# Altium schematic sheet 2_SoC.schdoc.schdoc
size 495 x 241 mm; Name: A_A4; Symbol: A_A4; Device: A_A4; @Project Name: Радіо-пристрій Urobo 02; REV: 1.0; Date: 2023-10-07; Sheet: 2/2; Draw By: Nircus; Company: Urobo; Convert to PCB: yes; Add into BOM: yes
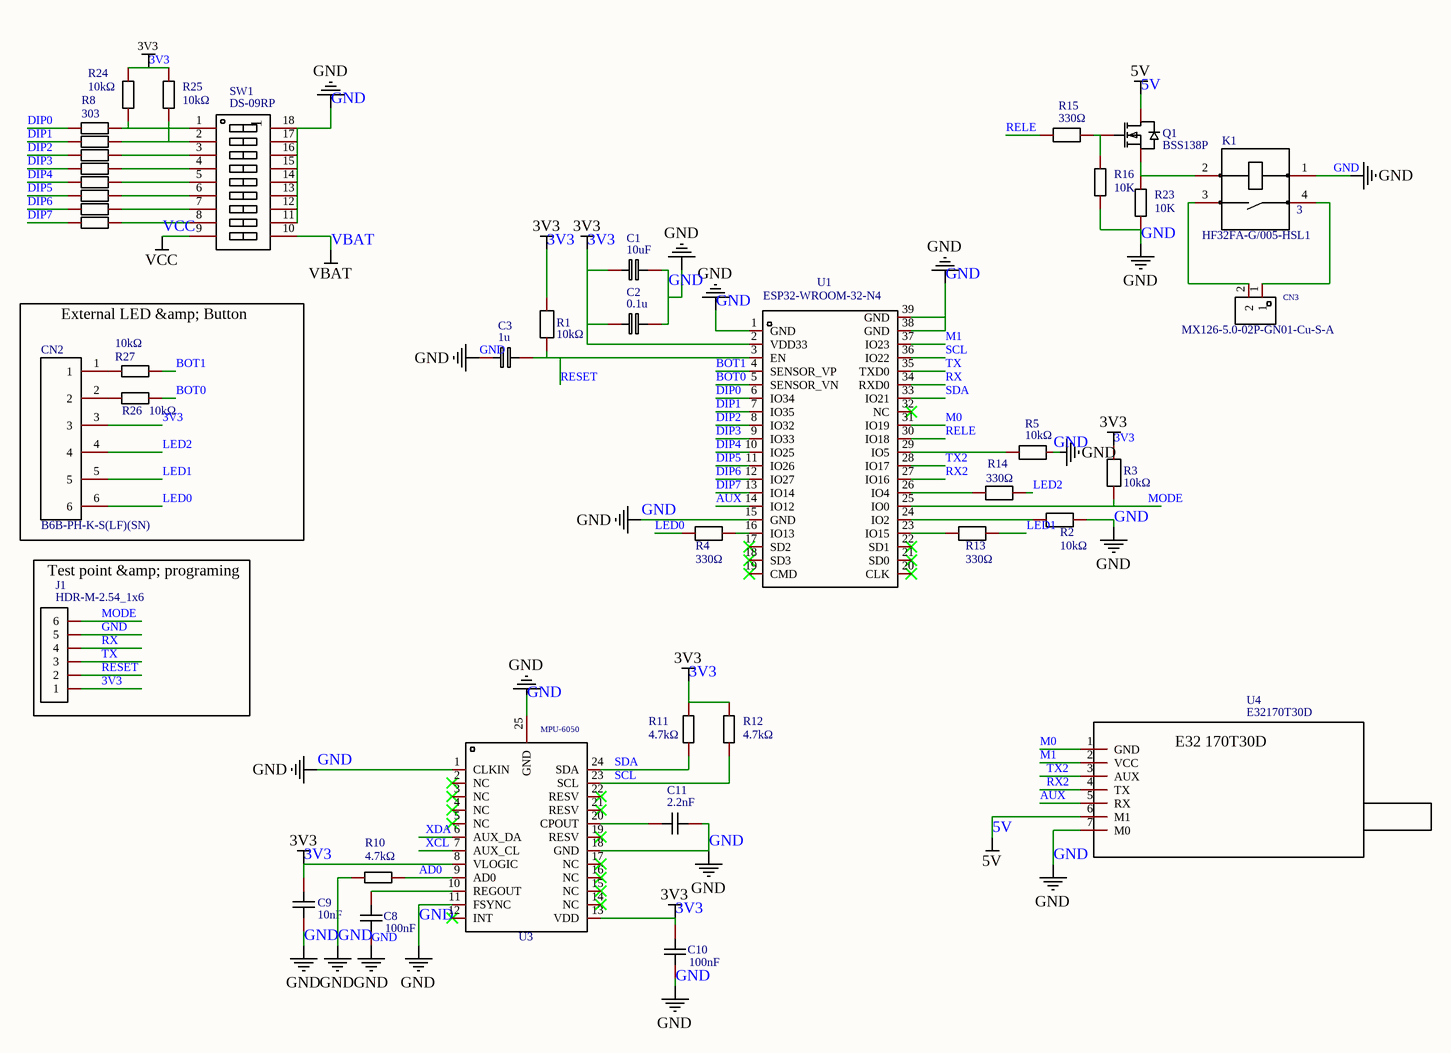
[diagram p0: 2_SoC.schdoc.schdoc]

## Parts
C1  10uF  [C0603]
C2  0.1u  [C0603]
C3  1u  [C0603]
C8  100nF  [C0402]
C9  10nF  [C0402]
C10  100nF  [C0402]
C11  2.2nF  [C0402]
CN2  B6B-PH-K-S(LF)(SN)  [CONN-TH_B6B-PH-K-S]
CN3  MX126-5.0-02P-GN01-Cu-S-A  [CONN-TH_2P-P5.00_MX126-5.0-GN01-02P-CU-S-A]
J1  HDR-M-2.54_1x6  [HDR-M-2.54_1X6]
K1  NUMBER: 3  [RELAY-TH_HF32FA-XX-HXX1X]  (hidden comment: HF32FA-G/005-HSL1)
Q1  BSS138P  [SOT-23-3_L2.9-W1.3-P1.90-LS2.4-BR]
R1  10kΩ  [R0402]
R2  10kΩ  [R0402]
R3  10kΩ  [R0402]
R4  330Ω  [R0603]
R5  10kΩ  [R0402]
R8  303  [R0402]
R9  303  [R0402]  (value not drawn)
R10  4.7kΩ  [R0402]
R11  4.7kΩ  [R0402]
R12  4.7kΩ  [R0402]
R13  330Ω  [R0603]
R14  330Ω  [R0603]
R15  330Ω  [R0603]
R16  10K  [R0402]
R17  303  [R0402]  (value not drawn)
R18  303  [R0402]  (value not drawn)
R19  303  [R0402]  (value not drawn)
R20  303  [R0402]  (value not drawn)
R21  303  [R0402]  (value not drawn)
R22  303  [R0402]  (value not drawn)
R23  10K  [R0402]
R24  10kΩ  [R0402]
R25  10kΩ  [R0402]
R26  10kΩ  [R0402]
R27  10kΩ  [R0402]
SW1  DS-09RP  [SW-TH_18P-L24.4-W9.9-P2.54-LS7.6]
U1  ESP32-WROOM-32-N4  [WIFIM-SMD_ESP32-WROOM-32-N4]
U3  MPU-6050  [QFN-24_L4.0-W4.0-P0.50-BL-EP2.7]
U4  E32170T30D  [E32170T30]

## Blocks framed on the sheet
External LED &amp; Button: CN2 R26 R27
Test point &amp; programing: J1

## Nets
3V3: C1.1 C2.1 C9.1 C10.2 CN2.3 J1.1 R1.2 R3.2 R11.2 R12.2 R24.2 R25.2 U1.2(VDD33) U3.8(VLOGIC) U3.13(VDD)
5V: Q1.3(D) U4.6(M1)
GND: C1.2 C2.2 C3.1 C8.1 C9.2 C10.1 C11.2 J1.5 K1.1 R2.2 R5.2 R10.2 R16.1 R23.1 SW1.11(PIN11) SW1.12(PIN12) SW1.13(PIN13) SW1.14(PIN14) SW1.15(PIN15) SW1.16(PIN16) SW1.17(PIN17) SW1.18(PIN18) U1.1(GND) U1.15(GND) U1.38(GND) U1.39(GND) U3.1(CLKIN) U3.11(FSYNC) U3.18(GND) U3.25(GND) U4.7(M0)
VBAT: SW1.10(PIN10)
VCC: SW1.9(PIN9)
AD0: R10.1 U3.9(AD0)
AUX: U1.14(IO12) U4.5(RX)
BOT0: R26.1 U1.5(SENSOR_VN)
BOT1: R27.1 U1.4(SENSOR_VP)
DIP0: R8.1 U1.6(IO34)
DIP1: R9.1 U1.7(IO35)
DIP2: R17.1 U1.8(IO32)
DIP3: R18.1 U1.9(IO33)
DIP4: R19.1 U1.10(IO25)
DIP5: R20.1 U1.11(IO26)
DIP6: R21.1 U1.12(IO27)
DIP7: R22.1 U1.13(IO14)
LED0: CN2.6 R4.1
LED1: CN2.5 R13.2
LED2: CN2.4 R14.2
M0: U1.31(IO19) U4.1(GND)
M1: U1.37(IO23) U4.2(VCC)
MODE: J1.6 R3.1 U1.25(IO0)
RELE: R15.1 U1.30(IO18)
RESET: C3.2 J1.2 R1.1 U1.3(EN)
RX: J1.4 U1.34(RXD0)
RX2: U1.27(IO16) U4.4(TX)
SCL: R12.1 U1.36(IO22) U3.23(SCL)
SDA: R11.1 U1.33(IO21) U3.24(SDA)
TX: J1.3 U1.35(TXD0)
TX2: U1.28(IO17) U4.3(AUX)
XCL: U3.7(AUX_CL)
XDA: U3.6(AUX_DA)
NetC8_2: C8.2 U3.10(REGOUT)
NetC11_1: C11.1 U3.20(CPOUT)
NetCN2_1: CN2.1 R27.2
NetCN2_2: CN2.2 R26.2
NetCN3_1: CN3.1 K1.4
NetCN3_2: CN3.2 K1.3
NetK1_2: K1.2 Q1.2(S) R23.2
NetQ1_1: Q1.1(G) R15.2 R16.2
NetR2_1: R2.1 U1.24(IO2)
NetR4_2: R4.2 U1.16(IO13)
NetR5_1: R5.1 U1.29(IO5)
NetR8_2: R8.2 R24.1 SW1.1(PIN1)
NetR9_2: R9.2 R25.1 SW1.2(PIN2)
NetR13_1: R13.1 U1.23(IO15)
NetR14_1: R14.1 U1.26(IO4)
NetR17_2: R17.2 SW1.3(PIN3)
NetR18_2: R18.2 SW1.4(PIN4)
NetR19_2: R19.2 SW1.5(PIN5)
NetR20_2: R20.2 SW1.6(PIN6)
NetR21_2: R21.2 SW1.7(PIN7)
NetR22_2: R22.2 SW1.8(PIN8)

Not connected (* = marked no-connect by the designer): U1 17(SD2)* 18(SD3)* 19(CMD)* 20(CLK)* 21(SD0)* 22(SD1)* 32(NC)*; U3 2(NC)* 3(NC)* 4(NC)* 5(NC)* 12(INT)* 14(NC)* 15(NC)* 16(NC)* 17(NC)* 19(RESV)* 21(RESV)* 22(RESV)*

## Notes on the sheet
- 1
- 2
- 3
- 4
- 5
- A
- B
- C
- D
- TITLE:
- Радіо-пристрій Urobo 02
- REV:
- 1.0
- Date:
- Company:
- 2023-10-07
- Urobo
- Drawn By:
- Nircus
- Sheet:
- 2/2
- (in symbol E32170T30D) E32 170T30D

## Library data of the parts
C1 = CL10A106MQ8NNNC: Capacitance: Tolerance:±20% Tolerance:±20% Voltage Rated: Temperature Coefficient:; Manufacturer: SAMSUNG(三星); Symbol: 10u; Add into BOM: yes; Tolerance: ±20%; Name: 10uF; Device: CL10A106MQ8NNNC; LCSC Part Name: 10uF ±20% 6.3V; Supplier Part: C1691; Manufacturer Part: CL10A106MQ8NNNC; Supplier Footprint: 0603; JLCPCB Part Class: Extended Part; Datasheet: https://atta.szlcsc.com/upload/public/pdf/source/20160103/1457707690948.pdf; Supplier: LCSC; Convert to PCB: yes; Value: 10uF; Origin Footprint: C0603
C2 = 0.1u: Manufacturer Part: C0603C104K5RACAUTO; Manufacturer: KEMET(基美); Convert to PCB: yes; Name: 0.1u; Symbol: 0.1u; Device: 0.1u; Supplier Part: C129621; Supplier: LCSC; Add into BOM: yes; Origin Footprint: C0603
C3 = 1u: Manufacturer Part: CC0603ZRY5V8BB105; Manufacturer: YAGEO(国巨); Convert to PCB: yes; Name: 1u; Symbol: 1u; Device: 1u; Supplier Part: C106848; Supplier: LCSC; Add into BOM: yes; Origin Footprint: C0603
C8 C10 = FCC0402B104K250AT: Capacitance: Tolerance:±10% Tolerance:±10% Voltage Rated: Temperature Coefficient:; Manufacturer: FOJAN(富捷); Add into BOM: yes; Tolerance: ±10%; Name: 100nF; Symbol: 100nF; Device: FCC0402B104K250AT; LCSC Part Name: 100nF ±10% 25V; Supplier Part: C5137489; Manufacturer Part: FCC0402B104K250AT; Supplier Footprint: 0402; JLCPCB Part Class: Extended Part; Datasheet: https://atta.szlcsc.com/upload/public/pdf/source/20220818/0EB3B7FB2F5648AC16609637FBA7DABE.pdf; Supplier: LCSC; Convert to PCB: yes; Value: 100nF; Origin Footprint: C0402; link: https://lcsc.com/eda_search?q=C272879&amp;%26type=1&amp;ref=editor
C9 = 10nF: Manufacturer: YAGEO(国巨); Manufacturer Part: CC0402KRX7R7BB103; Convert to PCB: yes; Name: 10nF; Symbol: 10nF; Device: 10nF; Supplier: LCSC; Supplier Part: C327009; JLCPCB Part Class: Extended Part; link: https://lcsc.com/eda_search?q=C327009&amp;%26type=1&amp;ref=editor; Add into BOM: yes; Origin Footprint: C0402
C11 = CC0402KRX7R6BB222: Capacitance: Tolerance:±10% Tolerance:±10% Voltage Rated: Temperature Coefficient:; Manufacturer: YAGEO(国巨); Add into BOM: yes; Tolerance: ±10%; Name: 2.2nF; Symbol: 2.2nF; Device: CC0402KRX7R6BB222; LCSC Part Name: 2.2nF ±10% 10V; Supplier Part: C541373; Manufacturer Part: CC0402KRX7R6BB222; Supplier Footprint: 0402; JLCPCB Part Class: Extended Part; Datasheet: https://atta.szlcsc.com/upload/public/pdf/source/20200615/C541373_6B623ACB8FC049B264195929A235C235.pdf; Supplier: LCSC; Convert to PCB: yes; Value: 2.2nF; Origin Footprint: C0402; link: https://lcsc.com/eda_search?q=C513667&amp;%26type=1&amp;ref=editor
CN2 = B6B-PH-K-S(LF)(SN)_C131342: Reference Series:PH Pitch:2mm Pins Structure:1x6P Number of Rows:1 Number of PINs Per Row:6 Row Spacing:- Mounting Style:- Contact Material:Brass; Manufacturer: JST; Add into BOM: yes; Reference Series: PH; Pitch: 2mm; Pins Structure: 1x6P; Number of PINs Per Row: 6; Name: B6B-PH-K-S(LF)(SN); Symbol: B6B-PH-K-S(LF)(SN); Device: B6B-PH-K-S(LF)(SN)_C131342; LCSC Part Name: PH 2mm 1x6P; Supplier Part: C131342; Manufacturer Part: B6B-PH-K-S(LF)(SN); Supplier Footprint: 直插,P=2mm; JLCPCB Part Class: Extended Part; Datasheet: https://atta.szlcsc.com/upload/public/pdf/source/20171026/C131342_15089839687311058815.pdf; Supplier: LCSC; Convert to PCB: yes; Number of Rows: 1; Row Spacing: -; Mounting Style: -; Contact Material: Brass
CN3 = MX126-5.0-02P-GN01-Cu-S-A: Pitch:5mm Structure:1x2P Number of Rows:1 Number of PINs Per Row:2 Mounting Style:直针 Current Rating (Max):10A Voltage Rating (Max):300V Wire Gauge - AWG:14~26 Wire Gauge - AWG:14~26 Wire Gauge - mm2:2.5 Wire Gauge - mm2:2.5 Operating Temperature Range:-40; Manufacturer: MAX(迈旭); Symbol: MX126-5.0-GN01-02P-CU-S-A; Add into BOM: yes; Pitch: 5mm; Structure: 1x2P; Number of PINs Per Row: 2; Current Rating (Max): 10A; Voltage Rating (Max): 300V; Wire Gauge - AWG: 14~26; Wire Gauge - mm2: 2.5; Name: MX126-5.0-02P-GN01-Cu-S-A; Device: MX126-5.0-02P-GN01-Cu-S-A; LCSC Part Name: 5mm 1x2P 排数:1 每排P数:2 直针; Supplier Part: C5188434; Manufacturer Part: MX126-5.0-02P-GN01-Cu-S-A; Supplier Footprint: 插件,P=5mm; JLCPCB Part Class: Extended Part; Datasheet: https://atta.szlcsc.com/upload/public/pdf/source/20221024/69A8295958E0DAFC8E5B6F48112698FA.pdf; Supplier: LCSC; Convert to PCB: yes; Number of Rows: 1; Mounting Style: 直针; Operating Temperature Range: -40℃~+105℃; Color: Green
J1 = HDR-M-2.54_1x6: Convert to PCB: yes; Name: HDR-M-2.54_1x6; Symbol: HDR-M-2.54_1x6; Device: HDR-M-2.54_1x6; Supplier Part: C190819; Supplier: LCSC; Add into BOM: yes; Origin Footprint: HDR-M-2.54_1X6
K1 = HF32FA-G/005-HSL1: Coil Voltage:5V Coil Type:非极化-单线圈 Pin Number:4 Contact Form:一组常开:1A(SPST-常开) Maximum Switching Current:10A Maximum Switching Voltage:250V@AC Coil Rated Power:230mW Contact Rating:10A@250VAC Coil Resistance:108Ω Operate Time:8ms Release Time:4ms Contact Re; Manufacturer: HF(宏发); Add into BOM: yes; Coil Voltage: 5V; Pin Number: 4; Maximum Switching Current: 10A; Coil Rated Power: 230mW; Coil Resistance: 108Ω; Operate Time: 8ms; Release Time: 4ms; Contact Resistance: 70mΩ; Name: HF32FA-G/005-HSL1; Symbol: HF32FA-G/005-HSL1; Device: HF32FA-G/005-HSL1; LCSC Part Name: HF32FA-G/005-HSL1; Supplier Part: C91370; Manufacturer Part: HF32FA-G/005-HSL1; Supplier Footprint: 插件,10.1x17.6mm; JLCPCB Part Class: Extended Part; Datasheet: https://atta.szlcsc.com/upload/public/pdf/source/20161226/1482720167443.pdf; Supplier: LCSC; Convert to PCB: yes; Coil Type: 非极化-单线圈; Contact Form: 一组常开:1A(SPST-常开); Maximum Switching Voltage: 250V@AC; Contact Rating: 10A@250VAC; Contact Material: AgSnO2; Operating Temperature: -40℃~+85℃
Q1 = BSS138P: Type: Drain Source Voltage (Vdss): Continuous Drain Current (Id): Power Dissipation (Pd): Drain Source On Resistance (RDS(on)@Vgs,Id):1.5Ω@10V,500mA; Manufacturer: ElecSuper(静芯微）; Symbol: BSS138P,215; Add into BOM: yes; Origin Footprint: SOT-23-3_L2.9-W1.6-P1.90-LS2.8-BR; Name: BSS138P; Device: BSS138P; LCSC Part Name: N沟道 50V 300mA; Supplier Part: C5224269; Manufacturer Part: BSS138P; Supplier Footprint: SOT-23; JLCPCB Part Class: Extended Part; Datasheet: https://atta.szlcsc.com/upload/public/pdf/source/20230109/19ED1CA0593D0FDF8F5097508834686B.pdf; Supplier: LCSC; Convert to PCB: yes; Drain Source On Resistance (RDS(on)@Vgs,Id): 1.5Ω@10V,500mA; link: https://lcsc.com/eda_search?q=C75547&amp;%26type=1&amp;ref=editor
R1 R3 R5 = SCR0402F10K: Resistance: Tolerance:±1% Tolerance:±1%; Manufacturer: VO(翔胜); Symbol: 10k; Add into BOM: yes; Tolerance: ±1%; Name: 10kΩ; Device: SCR0402F10K; LCSC Part Name: 10kΩ ±1%; Supplier Part: C3015825; Manufacturer Part: SCR0402F10K; Supplier Footprint: 0402; JLCPCB Part Class: Extended Part; Datasheet: https://atta.szlcsc.com/upload/public/pdf/source/20220513/247AF9639BA21CF93567DC289CCC6A22.pdf; Supplier: LCSC; Convert to PCB: yes; Value: 10kΩ; Origin Footprint: R0402
R2 = SCR0402F10K: Resistance: Tolerance:±1% Tolerance:±1%; Manufacturer: VO(翔胜); Symbol: 10k; Add into BOM: yes; Tolerance: ±1%; Origin Footprint: R0603; Name: 10kΩ; Device: SCR0402F10K; LCSC Part Name: 10kΩ ±1%; Supplier Part: C3015825; Manufacturer Part: SCR0402F10K; Supplier Footprint: 0402; JLCPCB Part Class: Extended Part; Datasheet: https://atta.szlcsc.com/upload/public/pdf/source/20220513/247AF9639BA21CF93567DC289CCC6A22.pdf; Supplier: LCSC; Convert to PCB: yes; Value: 10kΩ
R4 R13 R14 = SCR0603F330R: Resistance: Tolerance:±1% Tolerance:±1%; Manufacturer: VO(翔胜); Symbol: 1k; Add into BOM: yes; Tolerance: ±1%; Name: 330Ω; Device: SCR0603F330R; LCSC Part Name: 330Ω ±1%; Supplier Part: C3016255; Manufacturer Part: SCR0603F330R; Supplier Footprint: 0603; JLCPCB Part Class: Extended Part; Datasheet: https://atta.szlcsc.com/upload/public/pdf/source/20220513/247AF9639BA21CF93567DC289CCC6A22.pdf; Supplier: LCSC; Convert to PCB: yes; Value: 330Ω; Origin Footprint: R0603
R8-R12 R16-R23 = Res_0603: Symbol: Res; Convert to PCB: yes; Device: Res_0603; Add into BOM: yes; Supplier Footprint: 0603
  R8 R9 R17-R22: Name: 303; Value: 303; Supplier Part: C105875
  R10-R12: Name: 4.7kΩ; Value: 4.7kΩ; Supplier Part: C100658
  R16 R23: Name: 10K; Value: 10K; Supplier Part: C3015825
R15 = SCR0603F330R: Resistance: Tolerance:±1% Tolerance:±1%; Manufacturer: VO(翔胜); Symbol: 330; Add into BOM: yes; Tolerance: ±1%; Origin Footprint: R0402; Name: 330Ω; Device: SCR0603F330R; LCSC Part Name: 330Ω ±1%; Supplier Part: C3016255; Manufacturer Part: SCR0603F330R; Supplier Footprint: 0603; JLCPCB Part Class: Extended Part; Datasheet: https://atta.szlcsc.com/upload/public/pdf/source/20220513/247AF9639BA21CF93567DC289CCC6A22.pdf; Supplier: LCSC; Convert to PCB: yes; Value: 330Ω
R24-R27 = SCR0402F10K: Resistance: Tolerance:±1% Tolerance:±1%; Manufacturer: VO(翔胜); Symbol: Res; Add into BOM: yes; Tolerance: ±1%; Temperature Coefficient: ±200ppm/℃; Name: 10kΩ; Device: SCR0402F10K; LCSC Part Name: 10kΩ ±1%; Supplier Part: C3015825; Manufacturer Part: SCR0402F10K; Supplier Footprint: 0402; JLCPCB Part Class: Extended Part; Datasheet: https://atta.szlcsc.com/upload/public/pdf/source/20220513/247AF9639BA21CF93567DC289CCC6A22.pdf; Supplier: LCSC; Convert to PCB: yes; Value: 10kΩ; Type: Thick Film Resistors; Operating Temperature Range: -55℃~+155℃
SW1 = DS-09RP_C458083: Type:平拨，凸起式 Current Rating:25mA Voltage Rating:24V Circuit:SPST Number of Positions:9 Lead Pitch:2.54mm Operating Temperature:-20℃~+70℃ Operating Temperature:-20℃~+70℃ Operating Life:3000次 Color:Red; Manufacturer: 韩国韩荣; Symbol: NDS-09V; Add into BOM: yes; Current Rating: 25mA; Voltage Rating: 24V; Circuit: SPST; Number of Positions: 9; Operating Life: 3000次; Name: DS-09RP; Device: DS-09RP_C458083; LCSC Part Name: 红色9PIN-2.54mm立式直插正拨拨码开关; Supplier Part: C458083; Manufacturer Part: DS-09RP; Supplier Footprint: 插件; JLCPCB Part Class: Extended Part; Datasheet: https://atta.szlcsc.com/upload/public/pdf/source/20210810/ECF2F28B1CE673E7F9581E27682BDB10.pdf; Supplier: LCSC; Convert to PCB: yes; Type: 平拨，凸起式; Lead Pitch: 2.54mm; Operating Temperature: -20℃~+70℃; Color: Red; Origin Footprint: SW-TH_18P-L24.4-W9.9-P2.54-LS7.6; link: https://lcsc.com/eda_search?q=C501636&amp;%26type=1&amp;ref=editor
U1 = ESP32-WROOM-32-N4: Manufacturer: ESPRESSIF(乐鑫); Symbol: ESP32-WROOM-32(16MB); Add into BOM: yes; Origin Footprint: WIFIM-SMD_39P-L25.5-W18.0-P1.27; Name: ESP32-WROOM-32-N4; Device: ESP32-WROOM-32-N4; LCSC Part Name: ESP32-WROOM-32-N4; Supplier Part: C82899; Manufacturer Part: ESP32-WROOM-32-N4; Supplier Footprint: WIFI无线 Module; JLCPCB Part Class: Extended Part; Datasheet: https://atta.szlcsc.com/upload/public/pdf/source/20210719/C82899_2D52724B6FAFABC419BCF308C5944296.pdf; Supplier: LCSC; Convert to PCB: yes; link: https://lcsc.com/eda_search?q=C529581&amp;%26type=1&amp;ref=editor
U3 = MPU-6050: Manufacturer: TDK InvenSense(应美盛); Symbol: NO; Add into BOM: yes; Origin Footprint: MPU6050; Name: MPU-6050; Device: MPU-6050; LCSC Part Name: MPU-6050; Supplier Part: C24112; Manufacturer Part: MPU-6050; Supplier Footprint: QFN-24(4x4); JLCPCB Part Class: Basic Part; Datasheet: https://atta.szlcsc.com/upload/public/pdf/source/20140425/1457707046159.pdf; Supplier: LCSC; Convert to PCB: yes
U4 = E32170T30D: Convert to PCB: yes; Name: E32170T30D; Symbol: E32170T30D; Device: E32170T30D; Add into BOM: yes; Origin Footprint: E32170T30